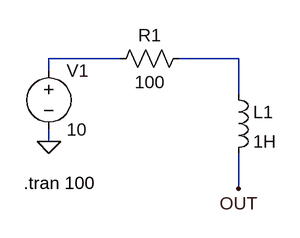
[diagram p0: schematic rl.asc]
rl.asc, the LTspice schematic file:
Version 4
SHEET 1 880 680
WIRE 128 48 32 48
WIRE 288 48 208 48
WIRE 32 64 32 48
WIRE 288 96 288 48
WIRE 32 160 32 144
WIRE 288 224 288 176
FLAG 32 160 0
FLAG 288 224 OUT
SYMBOL res 224 32 R90
WINDOW 0 0 56 VBottom 2
WINDOW 3 32 56 VTop 2
SYMATTR InstName R1
SYMATTR Value 100
SYMBOL ind 272 80 R0
SYMATTR InstName L1
SYMATTR Value 1H
SYMBOL voltage 32 48 R0
SYMATTR InstName V1
SYMATTR Value 10
TEXT -2 216 Left 2 !.tran 100

The netlist it stands for:
* rl.asc
R1 N002 N001 100
L1 N002 OUT 1H
V1 N001 0 10
.tran 100
.backanno
.end